# Altium project KNOx_PCB.PrjPcb
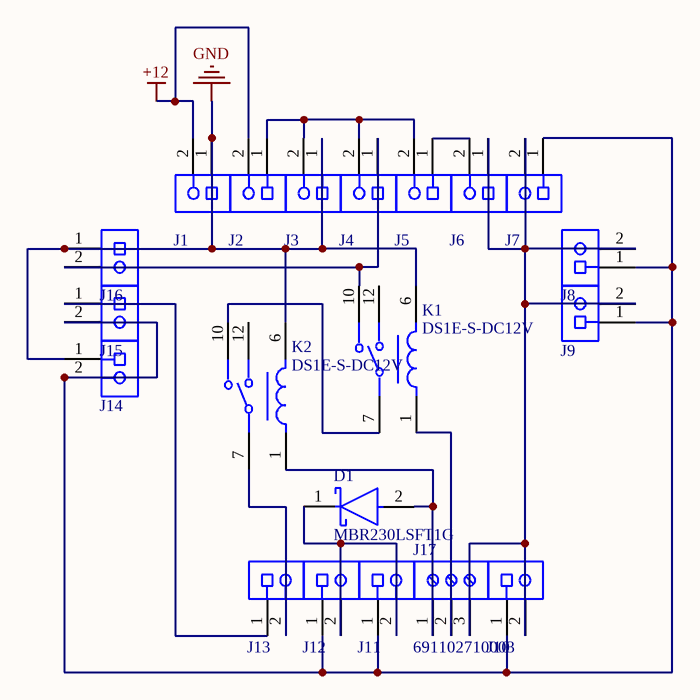
[diagram p0: Sheet1.SchDoc]
1 sheet, 20 parts. Net scope: global (net labels, ports and power ports of the same name join across sheets).
Board file: PCB1.PcbDoc

## Sheet Sheet1.SchDoc
size A4; SheetNumber: 1; SheetTotal: 1

### Parts
D1  MBR230LSFT1G  [FP-498-MFG]
J1  1729128  [PHOE-1729128-2_V]  (value not drawn)
J2  1729128  [PHOE-1729128-2_V]  (value not drawn)
J3  1729128  [PHOE-1729128-2_V]  (value not drawn)
J4  1729128  [PHOE-1729128-2_V]  (value not drawn)
J5  1729128  [PHOE-1729128-2_V]  (value not drawn)
J6  1729128  [PHOE-1729128-2_V]  (value not drawn)
J7  1729128  [PHOE-1729128-2_V]  (value not drawn)
J8  1729128  [PHOE-1729128-2_V]  (value not drawn)
J9  1729128  [PHOE-1729128-2_V]  (value not drawn)
J10  1729128  [PHOE-1729128-2_V]  (value not drawn)
J11  1729128  [PHOE-1729128-2_V]  (value not drawn)
J12  1729128  [PHOE-1729128-2_V]  (value not drawn)
J13  1729128  [PHOE-1729128-2_V]  (value not drawn)
J14  1729128  [PHOE-1729128-2_V]  (value not drawn)
J15  1729128  [PHOE-1729128-2_V]  (value not drawn)
J16  1729128  [PHOE-1729128-2_V]  (value not drawn)
J17  691102710003  [691102710003]
K1  DS1E-S-DC12V  [FP-DS1E-S-DC12V-MFG]
K2  DS1E-S-DC12V  [FP-DS1E-S-DC12V-MFG]

### Nets
+12: J1.2 J2.2
GND: J1.1 J3.1 J14.1 J16.1 K1.6(-) K2.6(-)
NetD1_1: D1.1(C) J11.2 J12.2
NetD1_2: D1.2(A) J17.1 K2.1(+)
NetJ2_1: J2.1 J3.2 J4.2 J5.2
NetJ4_1: J4.1 J16.2 K1.10(N.C.)
NetJ5_1: J5.1 J6.2
NetJ6_1: J6.1 J7.2 J8.2 J9.2 J10.2 J17.3
NetJ7_1: J7.1 J8.1 J9.1 J10.1 J11.1 J12.1 J14.2 J15.2
NetJ13_1: J13.1 J15.1
NetJ13_2: J13.2 K2.7(COM)
NetJ17_2: J17.2 K1.1(+)
NetK1_7: K1.7(COM) K2.10(N.C.)

Not connected (* = marked no-connect by the designer): K1 12(N.O.); K2 12(N.O.)

### Library data of the parts
D1 = CMP-1055-00442-2: DIODE SCHOTTKY 30V 2A SOD123L; Max Forward Surge Current (Ifsm): 40A; Element Configuration: Single; Forward Voltage: 430mV; Peak Reverse Current: 1mA; Max Reverse Voltage (DC): 30V; Max Operating Temperature: 125°C; Max Repetitive Reverse Voltage (Vrrm): 30V; Forward Current: 2A; Package Quantity: 1; Height: 0.9mm; REACH SVHC: No SVHC; Contact Plating: Tin; Min Operating Temperature: -55°C; Lead Free: Lead Free; Average Rectified Current: 2A; Halogen Free: Halogen Free; Peak Non-Repetitive Surge Current: 40A; Radiation Hardening: No; Case/Package: SOD; Number of Pins: 2; Packaging: Tape and Reel; Width: 1.8mm; Length: 2.9mm
J1-J16 = CMP-2000-05815-1: PCB Terminal Block, 13.5 A, 400 V, 2-Pin THD, RoHS, Bulk; Manufacturer: Phoenix Contact; Package Version: 03/2015; No. of Rows: 1; Pitch: 5.08mm; No. of Positions: 2; Voltage Rating: 400V; Current Rating: 13500mA; Manufacturer URL: http://www.phoenixcontact.com/; Datasheet URL: https://datasheet.ciiva.com/16046/1729128-16046181.pdf; RoHS: TRUE; Package URL: https://www.phoenixcontact.com/online/portal/pi/pxc/product_detail_page/!ut/p/b1/3VdJjqNKFDxLH8AFycySyWY2ozFsEPOMMQaDOX1XedGL_1Vdm5YXJleknhSKeBkvI6EA8ncAo3AYoDhBQGco6KN7VURTdemj9us_IEKEZo_YHiPAEWEFmDGOHMORkqKYCORBZxgL7ZoaZYcbFFUZ3fqxSY6GOuxydWUuHqz1ynmMFygu583Bob0Ewr6Sd_l-5m-kAueHiB0jpRwZwe58wwtkpxtMYd_LmGcDRU02dRNEyWt6Y2ti5pSyJ_reIkzIulrqApdnbT11V5jnCKbYNCvhEM1MCpPByat_X379-iThf08CI5GfOPqfBeS3BRoBOdD55AKVv0iLwCMq-2BrzXWSGRH7pUGD9uwXQjiph3xL0DKQwdGa0JImiIOmBNOestqgwTHSSs2oOep-78apyXQBvNi8ZLaFjvjWvcaUEBu0MC6Wbe-d6mB0FAebo2lUWinqYaZs5DAYzV0RP9yitUjnGJ0iI9xhZkT42OCQNUJJhkgWINNQLP2JFP6OpMg3JCVg70jqHT0lvKOnhHf0lPuOnnLf0VPuWx6_dxwUIvwk5WMkT0kLL1mh61l2yZVSzG3pYV_bqo-mj6uMKwKwdnnW8Jh5RTOJzMOA5c-eJDaZQw4mTMPH02PvS_ZAqNVjVTo2WyYLkwH_KU1mmmG5kjRhDqPXLwwVHvVOjCM60-fpXvTDfMGW1PVFVS1r4e4yVDk4ZdNbkUHvqPqQSeian4UD39fNKmachqdJ1NJbyk8rXT9mXTvPk3oE5meulKGgiruPJek-4I9hTT6G8ZLOyRSm2RRVbThERQad5OS28hdt4YW4vG0stgYYzsWsK4_7y6DZMjJSCqri1kyiZR5vD7pwIrNR7QwPHTcLTI5qT7eRlpHrdGiupYlqQDJ7zy_CND8fWWBoLRXxk1RVcXiBQwbTD4Xi7KL-FuO94t9xaqweXzH; PartNumber: 1729128; Package Description: 2-Pin Through Hole Device, Body 8.1 x 10.16 mm, Pitch 5.08 mm; Datasheet Version: 12/2013; Mounting Technology: ThroughHole; Orientation: Horizontal; Package Reference: 1729128-2; Packing: Bulk
J17 = CMP-1502-03259-2: NexarPartId: 8917707; Current: 15A; Stripping Length: -6mm; Wire/Cable Gauge: 22AWG; Wire Gauge (Min): 14AWG; Pitch: 5.0038mm; Number of Positions Per Level: 3; Plating: Steel; Voltage Rating: 300V; Number of Levels: 1; RoHS: Compliant; Mount: Through Hole; Color: Blue; Length: 7.5mm; Packaging: Box; Min Operating Temperature: -40°C; Housing Material: Nylon; REACH SVHC: Unknown; Current Rating: 15A; Contact Material: Brass; Width: 16.2mm; Height: 13.4mm; Lead Pitch: 5mm; Number of Contacts: 3; Number of Pins: 3; Contact Plating: Tin; Voltage: 300V; Termination: Screw; Max Operating Temperature: 105°C; Wire Gauge (Max): 22AWG
K1 K2 = CMP-00287-40004987-1: DS1E-S-DC12V Relay; 2 A AC/DC (Switching), 3 A AC/DC (Carrying); Amber Sealed Type; 1 Form C; Number of Contacts: 1; Voltage Rating (AC): 250V; Current Rating: 2A; Throw Configuration: SPDT; Coil Power: 200mW; Rise Time: 3ms; Voltage Rating (DC): 220V; Coil Voltage (DC): 12V; Operate Time: 10ms; Coil Resistance: 720Ω; Power Rating: 60W; Coil Current: 16.7mA; Relay Type: General Purpose; Coil Type: Non-Latching; Max Current Rating: 3A; Approvals: CSA, UL; Release Time: 5ms; Contact Material: Silver; Max Operating Temperature: 70°C; Schedule B: 8536490050, 8536490050; Max Voltage Rating (AC): 250V; Ambient Temperature Range High: 70°C; Termination: PC Pin; Case/Package: DIP; Depth: 9.9mm; Radiation Hardening: No; Power Consumption: 200mW; NexarPartId: 40004987; Length: 15mm; Width: 9.9mm; Max Voltage Rating (DC): 220V; Height: 9.9mm; Contact Current Rating: 2A; RoHS: Compliant; Number of Pins: 5; Contact Plating: Gold, Silver; Lead Free: Lead Free; Min Operating Temperature: -40°C; Packaging: Bulk; Weight: 3.2g; REACH SVHC: No SVHC; Mount: PCB, Through Hole; Switching Current: 2A